# EAGLE design voltometer (EAGLE 5.11)
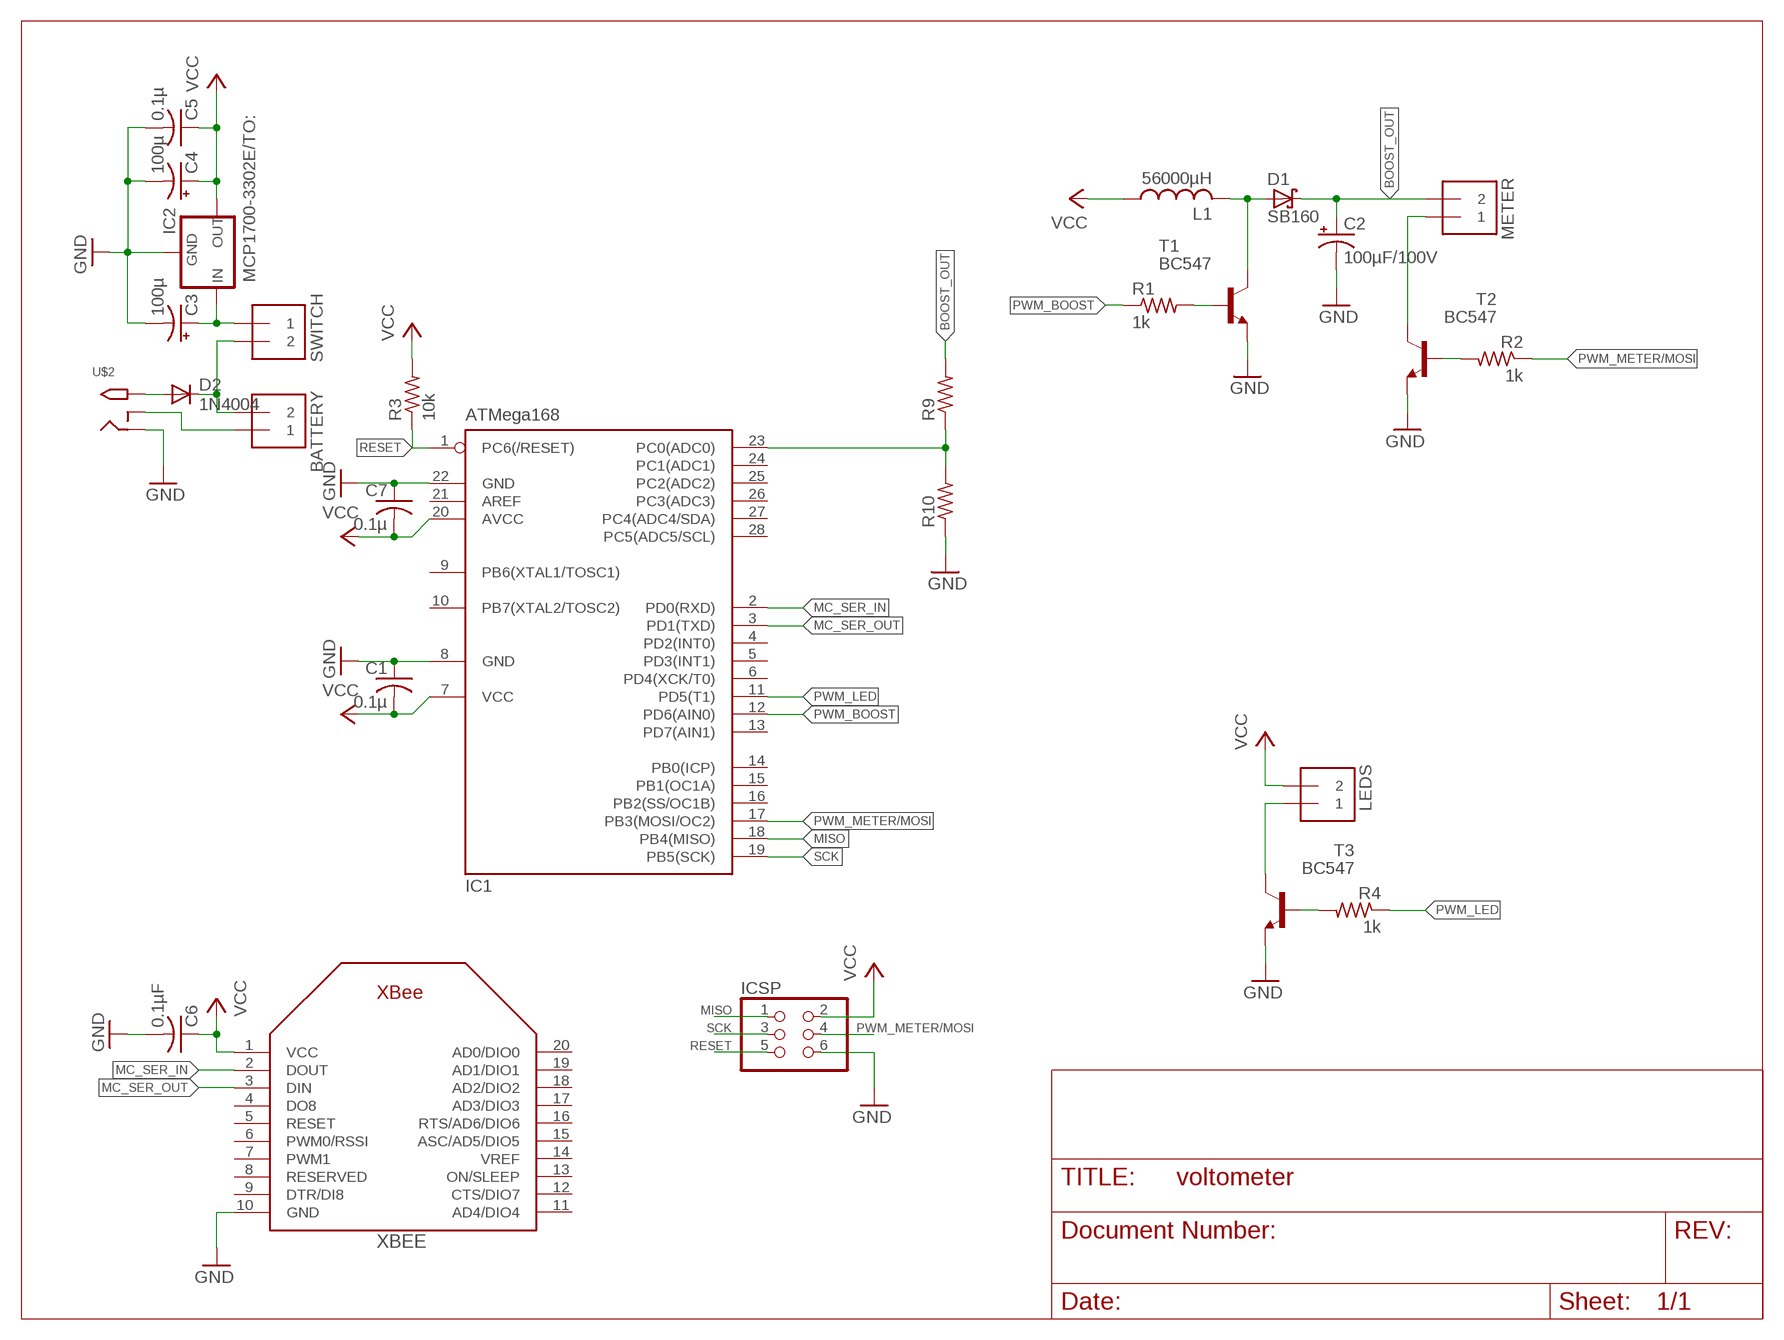
[diagram p0: schematic, sheet 1]

## Parts
BATTERY  1X2-3.5MM  [1X2-3.5MM]
C1  0.1µ  C-US025-025X050  [C025-025X050]
C2  100µF/100V  CPOL-USE5-8.5  [E5-8,5]
C3  100µ  CPOL-USE2-5  [E2-5]
C4  100µ  CPOL-USE2-5  [E2-5]
C5  0.1µ  C-US025-025X050  [C025-025X050]
C6  0.1µF  C-US025-025X050  [C025-025X050]
C7  0.1µ  C-US025-025X050  [C025-025X050]
D1  SB160  SCHOTTKY-DIODEDO41  [DO41-10]
D2  1N4004  [DO41-10]
IC1  ATMega168  MEGA8-P  [DIL28-3]
IC2  MCP1700-3302E/TO:  MCP1700INLINE  [TO92-INLINE]
ICSP  PINHEAD-EZ_PINHD-2X3  [PINHEAD-EZ_2X03]
L1  56000µH  L-US0204/5  [0204/5]
LEDS  1X2-3.5MM  [1X2-3.5MM]
METER  1X2-3.5MM  [1X2-3.5MM]
R1  1k  R-US_0207/12  [0207/12]
R2  1k  R-US_0207/12  [0207/12]
R3  10k  R-US_0207/12  [0207/12]
R4  1k  R-US_0207/12  [0207/12]
R9  R-US_0207/12  [0207/12]
R10  R-US_0207/12  [0207/12]
SWITCH  1X2-3.5MM  [1X2-3.5MM]
T1  BC547  -NPN-TO92-CBE  [TO92-CBE]
T2  BC547  -NPN-TO92-CBE  [TO92-CBE]
T3  BC547  -NPN-TO92-CBE  [TO92-CBE]
U$2  2.1MMJACKTHM  [PJ-102A]
XBEE  ULINK_XBEE  [ULINK_XBEE]

## Nets
BOOST_FEEDBACK: IC1.23(PC0(ADC0)) R9.1 R10.2
BOOST_OUT: C2.+ D1.C METER.2 R9.2
GND [power]: C1.1 C2.- C3.- C4.- C5.2 C6.2 C7.1 IC1.8(GND) IC1.22(GND) IC2.1(GND) ICSP.6 R10.1 T1.E T2.E T3.E U$2.RING XBEE.10(GND)
MC_SER_IN: IC1.2(PD0(RXD)) XBEE.2(DOUT)
MC_SER_OUT: IC1.3(PD1(TXD)) XBEE.3(DIN)
MISO: IC1.18(PB4(MISO)) ICSP.1
N$1 [power]: METER.1 T2.C
N$2: R1.2 T1.B
N$3 [power]: D1.A L1.2 T1.C
N$4: LEDS.1 T3.C
N$6 [power]: BATTERY.2 D2.C SWITCH.2
N$7: R2.2 T2.B
N$8: R4.2 T3.B
N$9 [power]: D2.A U$2.TIP
N$10 [power]: C3.+ IC2.2(IN) SWITCH.1
N$16 [power]: BATTERY.1 U$2.RING_SW
PWM_BOOST: IC1.12(PD6(AIN0)) R1.1
PWM_LED: IC1.11(PD5(T1)) R4.1
PWM_METER/MOSI: IC1.17(PB3(MOSI/OC2)) ICSP.4 R2.1
RESET: IC1.1(PC6(/RESET)) ICSP.5 R3.1
SCK: IC1.19(PB5(SCK)) ICSP.3
VCC [power]: C1.2 C4.+ C5.1 C6.1 C7.2 IC1.7(VCC) IC1.20(AVCC) IC2.3(OUT) ICSP.2 L1.1 LEDS.2 R3.2 XBEE.1(VCC)
Unconnected: IC1.4(PD2(INT0)) IC1.5(PD3(INT1)) IC1.6(PD4(XCK/T0)) IC1.9(PB6(XTAL1/TOSC1)) IC1.10(PB7(XTAL2/TOSC2)) IC1.13(PD7(AIN1)) IC1.14(PB0(ICP)) IC1.15(PB1(OC1A)) IC1.16(PB2(SS/OC1B)) IC1.21(AREF) IC1.24(PC1(ADC1)) IC1.25(PC2(ADC2)) IC1.26(PC3(ADC3)) IC1.27(PC4(ADC4/SDA)) IC1.28(PC5(ADC5/SCL)) XBEE.4(DO8) XBEE.5(RESET) XBEE.6(PWM0/RSSI) XBEE.7(PWM1) XBEE.8(RESERVED) XBEE.9(DTR/DI8) XBEE.11(AD4/DIO4) XBEE.12(CTS/DIO7) XBEE.13(ON/SLEEP) XBEE.14(VREF) XBEE.15(ASC/AD5/DIO5) XBEE.16(RTS/AD6/DIO6) XBEE.17(AD3/DIO3) XBEE.18(AD2/DIO2) XBEE.19(AD1/DIO1) XBEE.20(AD0/DIO0)

## Library data of the parts
BATTERY LEDS METER SWITCH = adafruit:1X2: 3.5mm Terminal block http://www.ladyada.net/library/pcb/eaglelibrary.html
C1 C5-C7 = rcl:C-US: CAPACITOR, American symbol
C2-C4 = rcl:CPOL-US: POLARIZED CAPACITOR, American symbol
D1 = adafruit:SCHOTTKY-DIODE: Schottky Diode
D2 = adafruit:1N4004: DIODE General purpose 1N400x type rectifier (With bigger pads) http://www.ladyada.net/library/pcb/eaglelibrary.html
IC1 = atmel:MEGA8-P: MICROCONTROLLER 8 Kbytes FLASH, 1 kbytes SRAM, 512 bytes EEPROM, USART, 4-channel 10 bit ADC, 2-channel 8 bit ADC Pin compatible with Atmega48, ATMega88, ATMega168 Source: avr.lbr
IC2 = adafruit:MCP1700: VOLTAGE REGULATOR
ICSP = boarduino:PINHEAD-EZ_PINHD-2X3: PIN HEADER
L1 = rcl:L-US: INDUCTOR, American symbol
R1-R4 R9 R10 = rcl:R-US_: RESISTOR, American symbol
T1-T3 = transistor-neu-to92:*-NPN-: NPN Transistror
U$2 = adafruit:2.1MMJACK: 2.1mm x 5.5mm THM DC jack with internal switch. Digikey part #PJ-102A, 4UCON part #05537 2.1mm x 5.5mm SMT DC jack with internal switch. Digikey part #PJ-002A-SMT, 4UCON part #03267 By microbuilder.eu & adafruit.com
XBEE = xbee:ULINK_XBEE

## Net classes
0 default: width 0.406 mm
1 power: width 0.406 mm

## Board
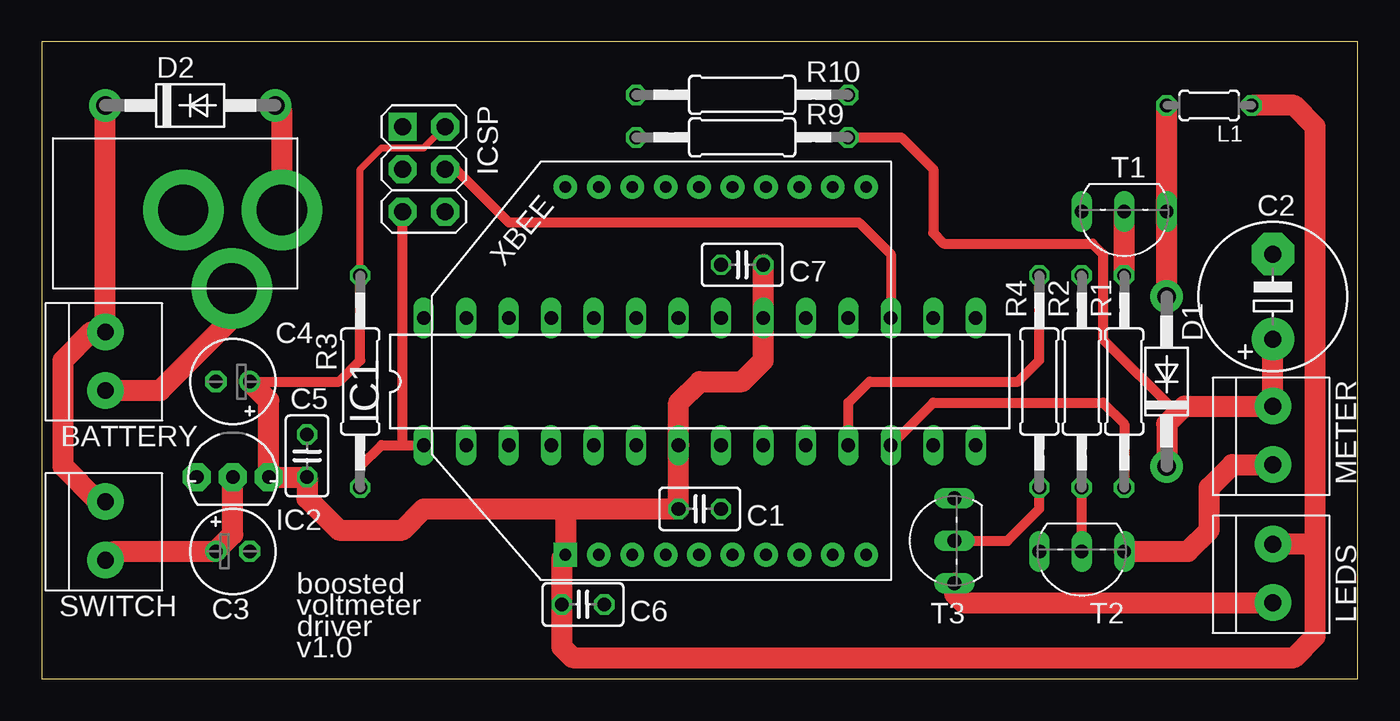
[diagram p1: board, top side]
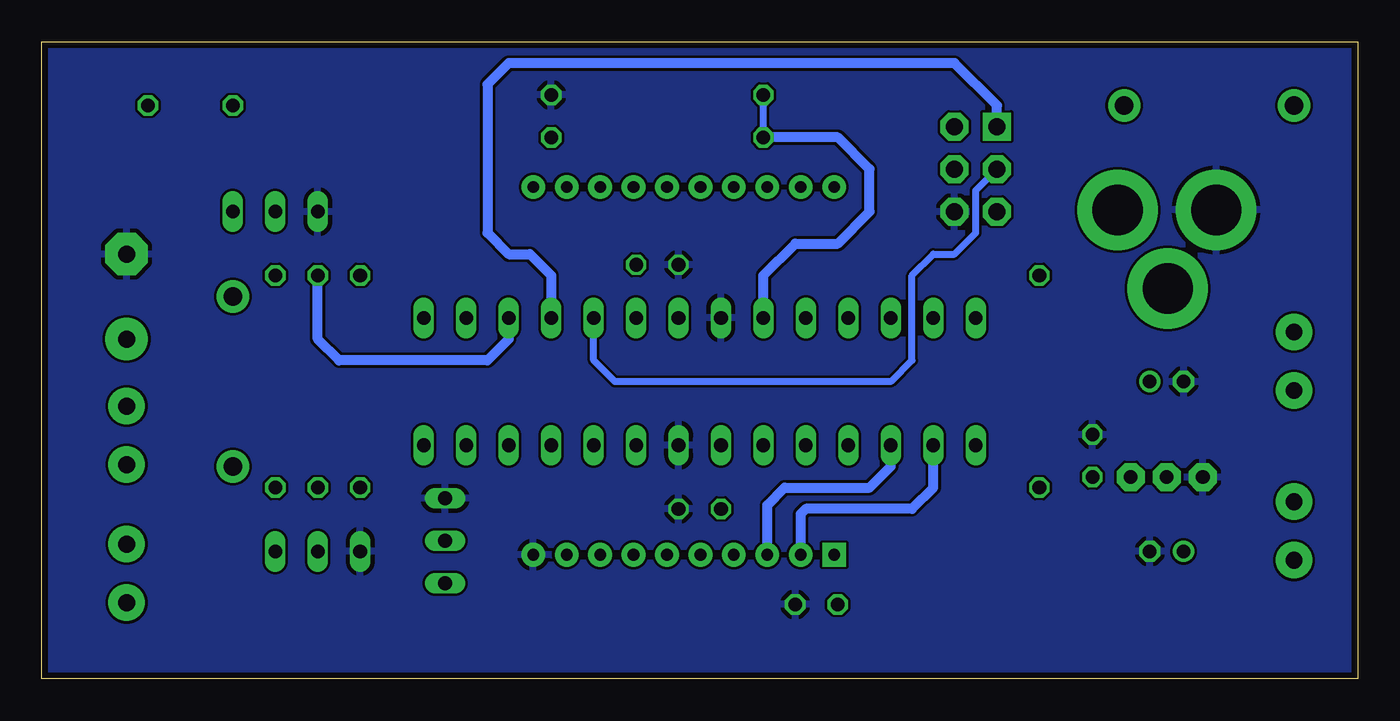
[diagram p2: board, bottom side, seen from below]

Size 78.74 x 38.1 mm. Coordinates in mm from the lower left corner, seen from the top.
Outline: 0,0 78.74,0 78.74,38.1 0,38.1 0,0
Copper layers (1*16): Top 0.0356mm / dielectric 1.5011mm / Bottom 0.0356mm
Design rules "LaenPCBOrder": minimum track width 6mil, minimum drill 13mil, track to track 6mil, track to pad 6mil, pad to pad 6mil, via to via 6mil, smd to smd 6mil, copper to edge 15mil, drill to drill 6mil, minimum pad ring 7mil, minimum via ring 7mil, stop-mask expansion 4mil, vias tented up to drill 0mil, thermal gap 10mil

### Footprints (pad centres in the part's own frame; a part is rotated, then mirrored left to right if it is on the bottom)
1X2-3.5MM = drill 1 pad 2.184 round: 1 1.8,0; 2 -1.7,0
C025-025X050 = drill 0.813 octagon: 1 -1.27,0; 2 1.27,0
E5-8,5 = drill 1.016 pad 2.54 round: + -2.54,0 | drill 1.016 pad 2.54 octagon: - 2.54,0
E2-5 = drill 0.813 pad 1.27 round: + -1.016,0 | drill 0.813 pad 1.27 octagon: - 1.016,0
DO41-10 = drill 1.118 pad 1.93 round: A 5.08,0; C -5.08,0
DIL28-3 = drill 0.813 long: 1 -16.51,-3.81; 2 -13.97,-3.81; 3 -11.43,-3.81; 4 -8.89,-3.81; 5 -6.35,-3.81; 6 -3.81,-3.81; 7 -1.27,-3.81; 8 1.27,-3.81; 9 3.81,-3.81; 10 6.35,-3.81; 11 8.89,-3.81; 12 11.43,-3.81; 13 13.97,-3.81; 14 16.51,-3.81; 15 16.51,3.81; 16 13.97,3.81; 17 11.43,3.81; 18 8.89,3.81; 19 6.35,3.81; 20 3.81,3.81; 21 1.27,3.81; 22 -1.27,3.81; 23 -3.81,3.81; 24 -6.35,3.81; 25 -8.89,3.81; 26 -11.43,3.81; 27 -13.97,3.81; 28 -16.51,3.81
TO92-INLINE = drill 0.813 pad 1.676 octagon: 1 -2.159,0; 2 0,0; 3 2.159,0
PINHEAD-EZ_2X03 = drill 1.016 pad 1.676 square: 1 -2.54,-1.27 | drill 1.016 pad 1.676 octagon: 2 -2.54,1.27; 3 0,-1.27; 4 0,1.27; 5 2.54,-1.27; 6 2.54,1.27
0204/5 = drill 0.813 octagon: 1 -2.54,0; 2 2.54,0
0207/12 = drill 0.813 octagon: 1 -6.35,0; 2 6.35,0
TO92-CBE = drill 0.813 long: B 0,0; C -2.54,0; E 2.54,0
PJ-102A = drill 3 pad 4.8 round: RING 0.1,-3.39; RING_SW -4.6,-6.29; TIP 0.1,-9.29
ULINK_XBEE = drill 0.7 pad 1.422 square: 1 -11,5.5 | drill 0.7 pad 1.422 round: 2 -11,3.5; 3 -11,1.5; 4 -11,-0.5; 5 -11,-2.5; 6 -11,-4.5; 7 -11,-6.5; 8 -11,-8.5; 9 -11,-10.5; 10 -11,-12.5; 11 11,-12.5; 12 11,-10.5; 13 11,-8.5; 14 11,-6.5; 15 11,-4.5; 16 11,-2.5; 17 11,-0.5; 18 11,1.5; 19 11,3.5; 20 11,5.5

### Placement (x,y rotation side)
BATTERY  3.81,19.05 270 top
C1  39.37,10.16 180 top
C2  73.66,22.86 90 top
C3  11.43,7.62 0 top
C4  11.43,17.78 180 top
C5  15.88,13.34 90 top
C6  32.38,4.45 0 top
C7  41.91,24.77 0 top
D1  67.31,17.78 90 top
D2  8.89,34.29 0 top
IC1  39.37,17.78 0 top
IC2  11.43,12.06 0 top
ICSP  22.86,30.48 270 top
L1  69.85,34.29 180 top
LEDS  73.66,6.35 270 top
METER  73.66,14.61 270 top
R1  64.77,17.78 90 top
R2  62.23,17.78 270 top
R3  19.05,17.78 90 top
R4  59.69,17.78 270 top
R9  41.91,32.38 0 top
R10  41.91,34.92 180 top
SWITCH  3.81,8.89 270 top
T1  64.77,27.94 180 top
T2  62.23,7.62 180 top
T3  54.61,8.26 90 top
U$2  5.08,27.94 90 top
XBEE  36.83,18.41 90 top

### Tracks (layer width: path | path; a pad name or v marks a point on that pad's centre or on a via)
BOOST_FEEDBACK
  Bottom 0.406: R9.1 R10.2
  Bottom 0.61: R9.1 31.12,32.38 29.21,30.48 29.21,27.94 31.12,26.04 33.66,26.04 35.56,24.13 IC1.23
BOOST_OUT
  Top 0.61: R9.2 51.44,32.38 53.34,30.48 53.34,26.67 53.98,26.04 62.87,26.04 63.5,25.4 63.5,20.32 67.94,15.88
  Top 1.27: C2.+ METER.2 68.38,16.3 67.94,15.88 67.31,15.24 D1.C
GND
  pour Bottom: 0,0 78.74,0 78.74,38.1 0,38.1
MC_SER_IN
  Bottom 0.61: XBEE.2 33.33,9.85 33.02,10.16 26.67,10.16 25.4,11.43 IC1.2
MC_SER_OUT
  Bottom 0.61: IC1.3 27.94,12.7 29.21,11.43 34.29,11.43 35.33,10.39 XBEE.3
MISO
  Bottom 0.61: ICSP.1 21.59,34.29 24.13,36.83 50.8,36.83 52.07,35.56 52.07,26.67 50.8,25.4 49.53,25.4 48.26,24.13 IC1.18
N$1
  Top 1.27: T2.C 68.58,7.62 69.85,8.89 69.85,11.43 71.22,12.8 METER.1
N$2
  Top 1.27: R1.2 T1.B
N$3
  Top 1.27: L1.2 T1.C D1.A
N$4
  Top 1.27: LEDS.1 55.14,4.55 54.61,5.08 T3.C
N$6
  Top 1.27: D2.C BATTERY.2 2.97,20.75 1.27,19.05 1.27,12.7 3.38,10.59 SWITCH.2
N$7
  Top 0.61: T2.B R2.2
N$8
  Top 0.61: T3.B 57.79,8.26 59.69,10.16 R4.2
N$9
  Top 1.27: U$2.TIP 14.37,33.89 D2.A
N$10
  Top 1.27: SWITCH.1 4.34,7.62 C3.+ 11.43,8.64 IC2.2
N$16
  Top 1.27: BATTERY.1 7.09,17.25 11.43,21.59 11.43,23.28 U$2.RING_SW
PWM_BOOST
  Top 0.61: IC1.12 53.34,16.51 63.5,16.51 64.77,15.24 R1.1
PWM_LED
  Top 0.61: IC1.11 48.26,16.51 49.53,17.78 58.42,17.78 59.69,19.05 R4.1
PWM_METER/MOSI
  Top 0.61: ICSP.4 24.77,30.48 27.94,27.3 48.9,27.3 50.8,25.4 IC1.17
  Bottom 0.61: R2.1 62.23,20.32 60.96,19.05 52.07,19.05 50.8,20.32 IC1.17
RESET
  Top 0.61: R3.1 19.05,12.7 20.32,13.97 21.59,13.97 | 21.59,13.97 IC1.1 | 21.59,13.97 ICSP.5
SCK
  Bottom 0.406: ICSP.3 22.86,29.21 22.86,26.67 24.13,25.4 25.4,25.4 26.67,24.13 26.67,19.05 27.94,17.78 44.45,17.78 45.72,19.05 IC1.19
VCC
  Top 0.406: R3.2 19.05,30.48 20.32,31.75 22.86,31.75 ICSP.2
  Top 0.61: R3.2 19.05,19.05 17.78,17.78 C4.+
  Top 1.27: C4.+ 13.59,16.64 IC2.3 C5.1 15.88,10.79 17.78,8.89 21.59,8.89 22.86,10.16 31.75,10.16 | C7.2 IC1.20 43.18,19.05 41.91,17.78 39.37,17.78 38.1,16.51 IC1.7 C1.2 31.75,10.16 | 31.75,10.16 31.33,9.74 XBEE.1 31.12,7.2 C6.1 31.12,1.91 31.75,1.27 74.93,1.27 76.2,2.54 76.2,7.62 | 76.2,7.62 76.2,33.02 74.93,34.29 L1.1 | LEDS.2 75.77,8.05 76.2,7.62

### Text on the board
tNames: boosted | voltmeter | driver | v1.0